# EAGLE design PICBoard (EAGLE 5.12)
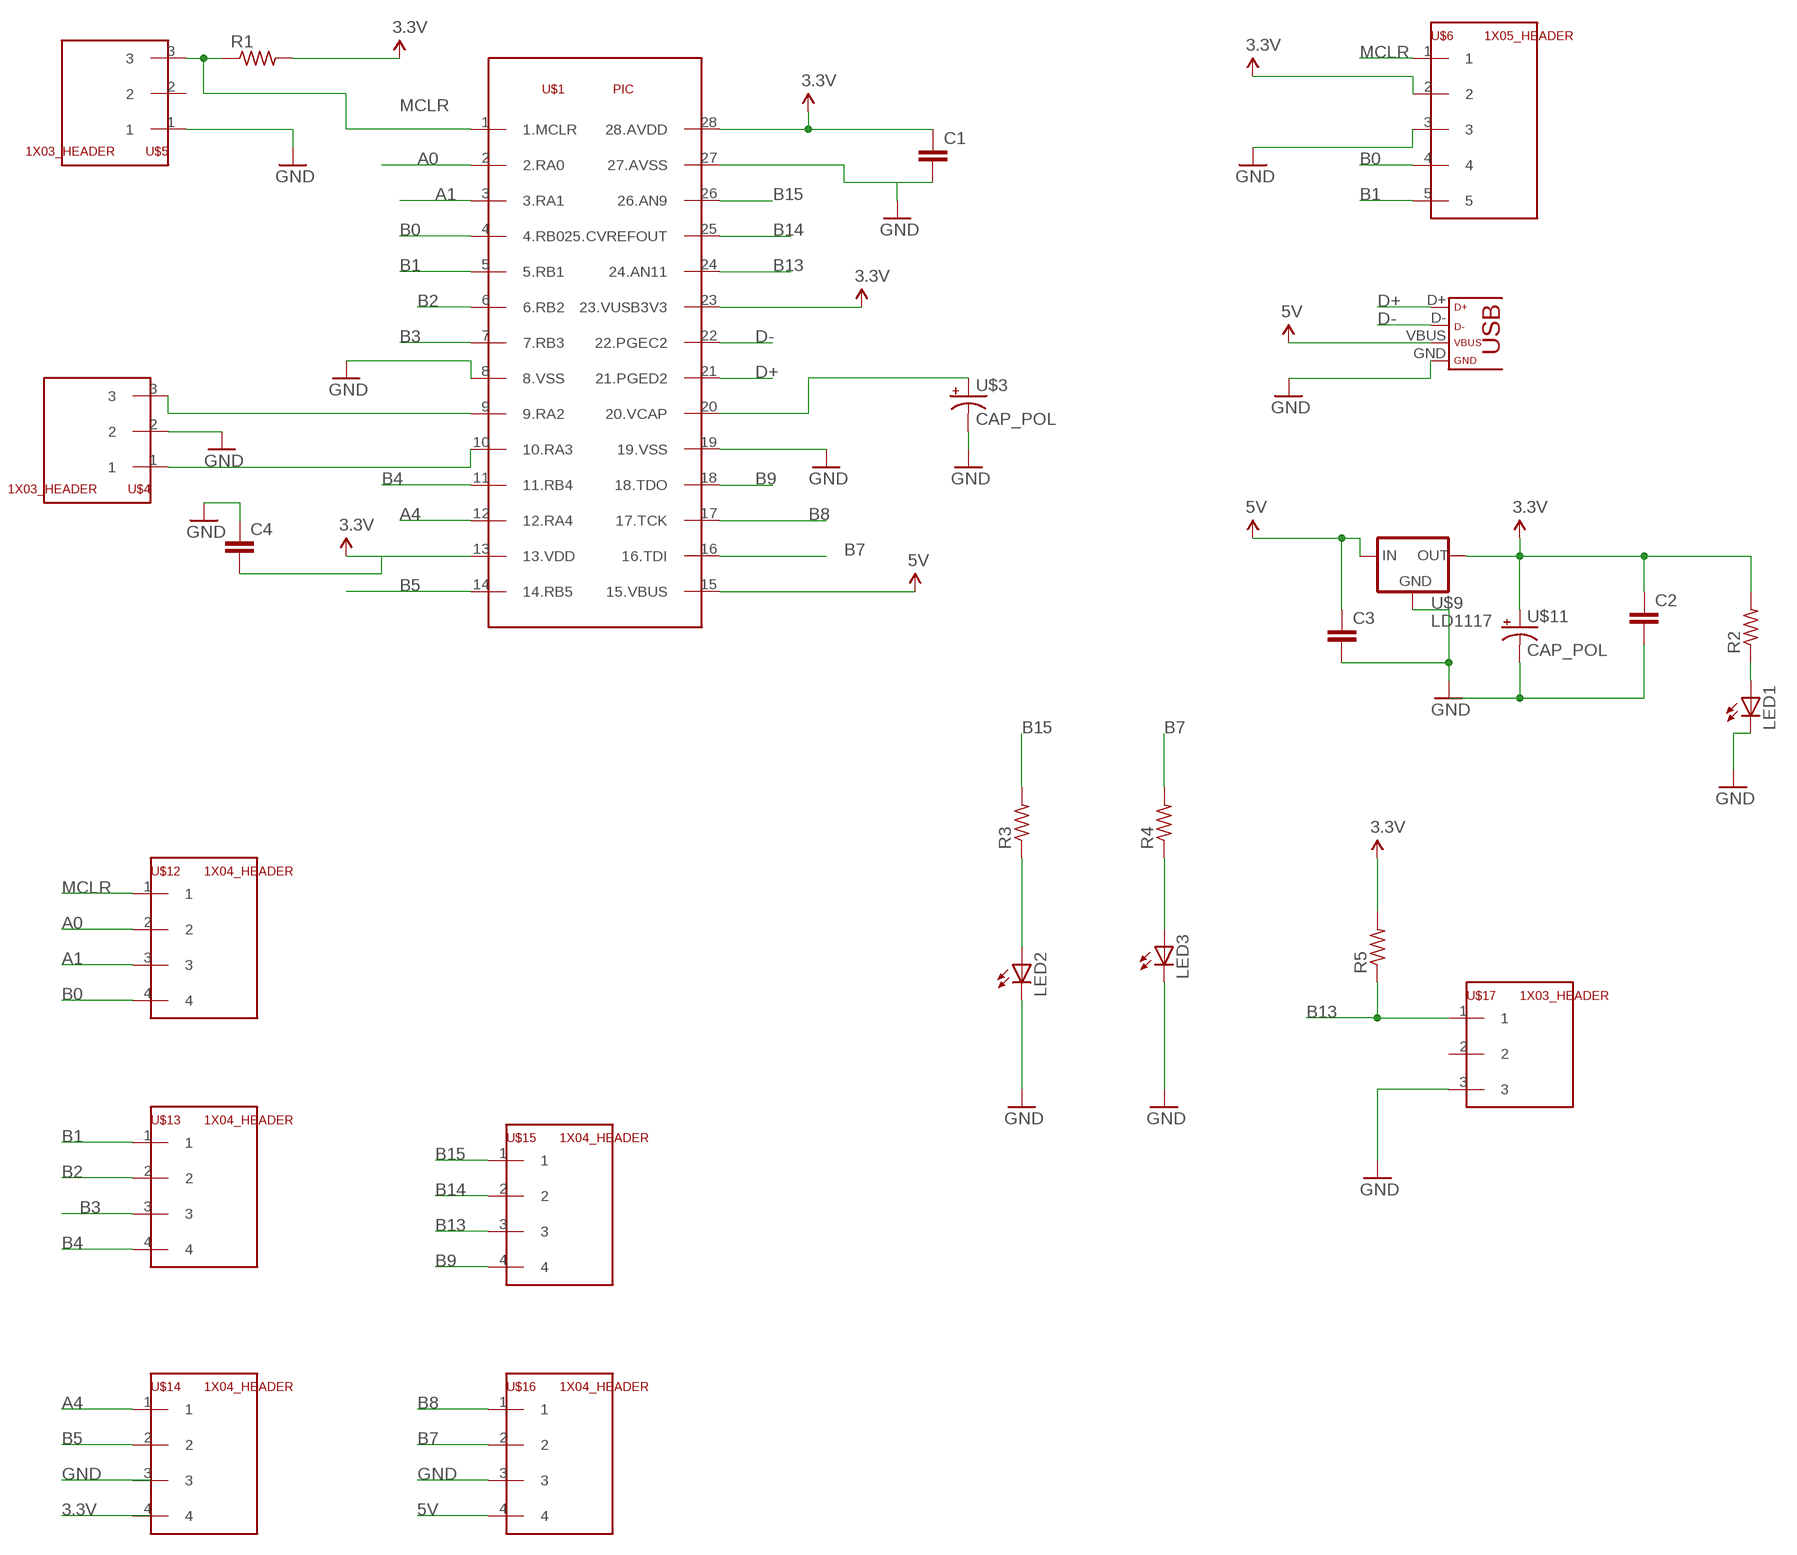
[diagram p0: schematic, sheet 1]

## Parts
C1  C-EU025-030X050  [C025-030X050]
C2  C-EU025-030X050  [C025-030X050]
C3  C-EU025-030X050  [C025-030X050]
C4  C-EU025-030X050  [C025-030X050]
LED1  LED3MM  [LED3MM]
LED2  LED3MM  [LED3MM]
LED3  LED3MM  [LED3MM]
R1  R-US_0207/12  [0207/12]
R2  R-US_0207/12  [0207/12]
R3  R-US_0207/12  [0207/12]
R4  R-US_0207/12  [0207/12]
R5  R-US_0207/12  [0207/12]
U$1  PIC  [DIL28-3]
U$3  CAP_POL  [CAP_POL_D]
U$4  1X03_HEADER  [1X03]
U$5  1X03_HEADER  [1X03]
U$6  1X05_HEADER  [1X05]
U$7  USB  [USB-MINIB]
U$9  LD1117  [TO220]
U$11  CAP_POL  [CAP_POL_D]
U$12  1X04_HEADER  [1X04]
U$13  1X04_HEADER  [1X04]
U$14  1X04_HEADER  [1X04]
U$15  1X04_HEADER  [1X04]
U$16  1X04_HEADER  [1X04]
U$17  1X03_HEADER  [1X03]

## Nets
3.3V: C1.1 C2.1 C4.2 R1.2 R2.2 R5.2 U$1.13(13.VDD) U$1.23(23.VUSB3V3) U$1.28(28.AVDD) U$6.2 U$9.2(OUT) U$11.1(+)
5V: C3.1 U$1.15(15.VBUS) U$7.VBUS U$9.3(IN) U$16.4
A0: U$1.2(2.RA0) U$12.2
A1: U$1.3(3.RA1) U$12.3
A4: U$1.12(12.RA4) U$14.1
B0: U$1.4(4.RB0) U$6.4 U$12.4
B1: U$1.5(5.RB1) U$6.5 U$13.1
B2: U$1.6(6.RB2) U$13.2
B3: U$1.7(7.RB3) U$13.3
B4: U$1.11(11.RB4) U$13.4
B5: U$1.14(14.RB5) U$14.2
B7: R4.2 U$1.16(16.TDI) U$16.2
B8: U$1.17(17.TCK) U$16.1
B9: U$1.18(18.TDO) U$15.4
B13: R5.1 U$1.24(24.AN11) U$15.3 U$17.1
B14: U$1.25(25.CVREFOUT) U$15.2
B15: R3.2 U$1.26(26.AN9) U$15.1
D+: U$1.21(21.PGED2) U$7.D+
D-: U$1.22(22.PGEC2) U$7.D-
GND: C1.2 C3.2 C4.1 LED1.K(C) LED2.K(C) LED3.K(C) U$1.8(8.VSS) U$1.19(19.VSS) U$1.27(27.AVSS) U$3.2(-) U$4.2 U$5.1 U$6.3 U$7.GND U$9.1(GND) U$16.3 U$17.3
MCLR: R1.1 U$1.1(1.MCLR) U$5.3 U$6.1 U$12.1
N$1: U$1.20(20.VCAP) U$3.1(+)
N$2: LED3.A R4.1
N$3: LED1.A R2.1
N$4: C2.2 U$11.2(-)
N$5: U$1.10(10.RA3) U$4.1
N$6: U$1.9(9.RA2) U$4.3
N$7: LED2.A R3.1
Unconnected: U$5.2 U$14.3 U$14.4 U$17.2

## Library data of the parts
C1-C4 = ME433_Hr:C-EU: CAPACITOR, European symbol
LED1-LED3 = ME433_Hr:LED: LED OSRAM: - CHIPLED LG R971, LG N971, LY N971, LG Q971, LY Q971, LO R971, LY R971 LH N974, LH R974 LS Q976, LO Q976, LY Q976 LO Q996 - Hyper CHIPLED LW Q18S LB Q993, LB Q99A, LB R99A - SideLED LS A670, LO A670, LY A670, LG A670, LP A670 LB A673, LV A673, LT A673, LW A673 LH A674 LY A675 LS A676, LA A676, LO A676, LY A676, LW A676 LS A679, LY A679, LG A679 - Hyper Micro SIDELED® LS Y876, LA Y876, LO Y876, LY Y876 LT Y87S - SmartLED LW L88C, LW L88S LB L89C, LB L89S, LG L890 LS L89K, LO L89K, LY L89K LS L896, LA L896, LO L896, LY L896 - TOPLED LS T670, LO T670, LY T670, LG T670, LP T670 LSG T670, LSP T670, LSY T670, LOP T670, LYG T670 LG T671, LOG T671, LSG T671 LB T673, LV T673, LT T673, LW T673 LH T674 LS T676, LA T676, LO T676, LY T676, LB T676, LH T676, LSB T676, LW T676 LB T67C, LV T67C, LT T67C, LS T67K, LO T67K, LY T67K, LW E67C LS E67B, LA E67B, LO E67B, LY E67B, LB E67C, LV E67C, LT E67C LW T67C LS T679, LY T679, LG T679 LS T770, LO T770, LY T770, LG T770, LP T770 LB T773, LV T773, LT T773, LW T773 LH T774 LS E675, LA E675, LY E675, LS T675 LS T776, LA T776, LO T776, LY T776, LB T776 LHGB T686 LT T68C, LB T68C - Hyper Mini TOPLED® LB M676 - Mini TOPLED Santana® LG M470 LS M47K, LO M47K, LY M47K Source: http://www.osram.convergy.de LUXEON: - LUMILED® LXK2-PW12-R00, LXK2-PW12-S00, LXK2-PW14-U00, LXK2-PW14-V00 LXK2-PM12-R00, LXK2-PM12-S00, LXK2-PM14-U00 LXK2-PE12-Q00, LXK2-PE12-R00, LXK2-PE12-S00, LXK2-PE14-T00, LXK2-PE14-U00 LXK2-PB12-K00, LXK2-PB12-L00, LXK2-PB12-M00, LXK2-PB14-N00, LXK2-PB14-P00, LXK2-PB14-Q00 LXK2-PR12-L00, LXK2-PR12-M00, LXK2-PR14-Q00, LXK2-PR14-R00 LXK2-PD12-Q00, LXK2-PD12-R00, LXK2-PD12-S00 LXK2-PH12-R00, LXK2-PH12-S00 LXK2-PL12-P00, LXK2-PL12-Q00, LXK2-PL12-R00 Source: www.luxeon.com KINGBRIGHT: KA-3528ASYC Source: www.kingbright.com
R1-R5 = ME433_Hr:R-US_: RESISTOR, American symbol
U$1 = ME433_Hr:PIC
U$3 U$11 = ME433_Hr:CAP_POL
U$4 U$5 U$17 = ME433_Hr:1X03_HEADER
U$6 = ME433_Hr:1X05_HEADER
U$7 = ME433_Hr:USB
U$9 = ME433_Hr:LD1117
U$12-U$16 = ME433_Hr:1X04_HEADER

## Board
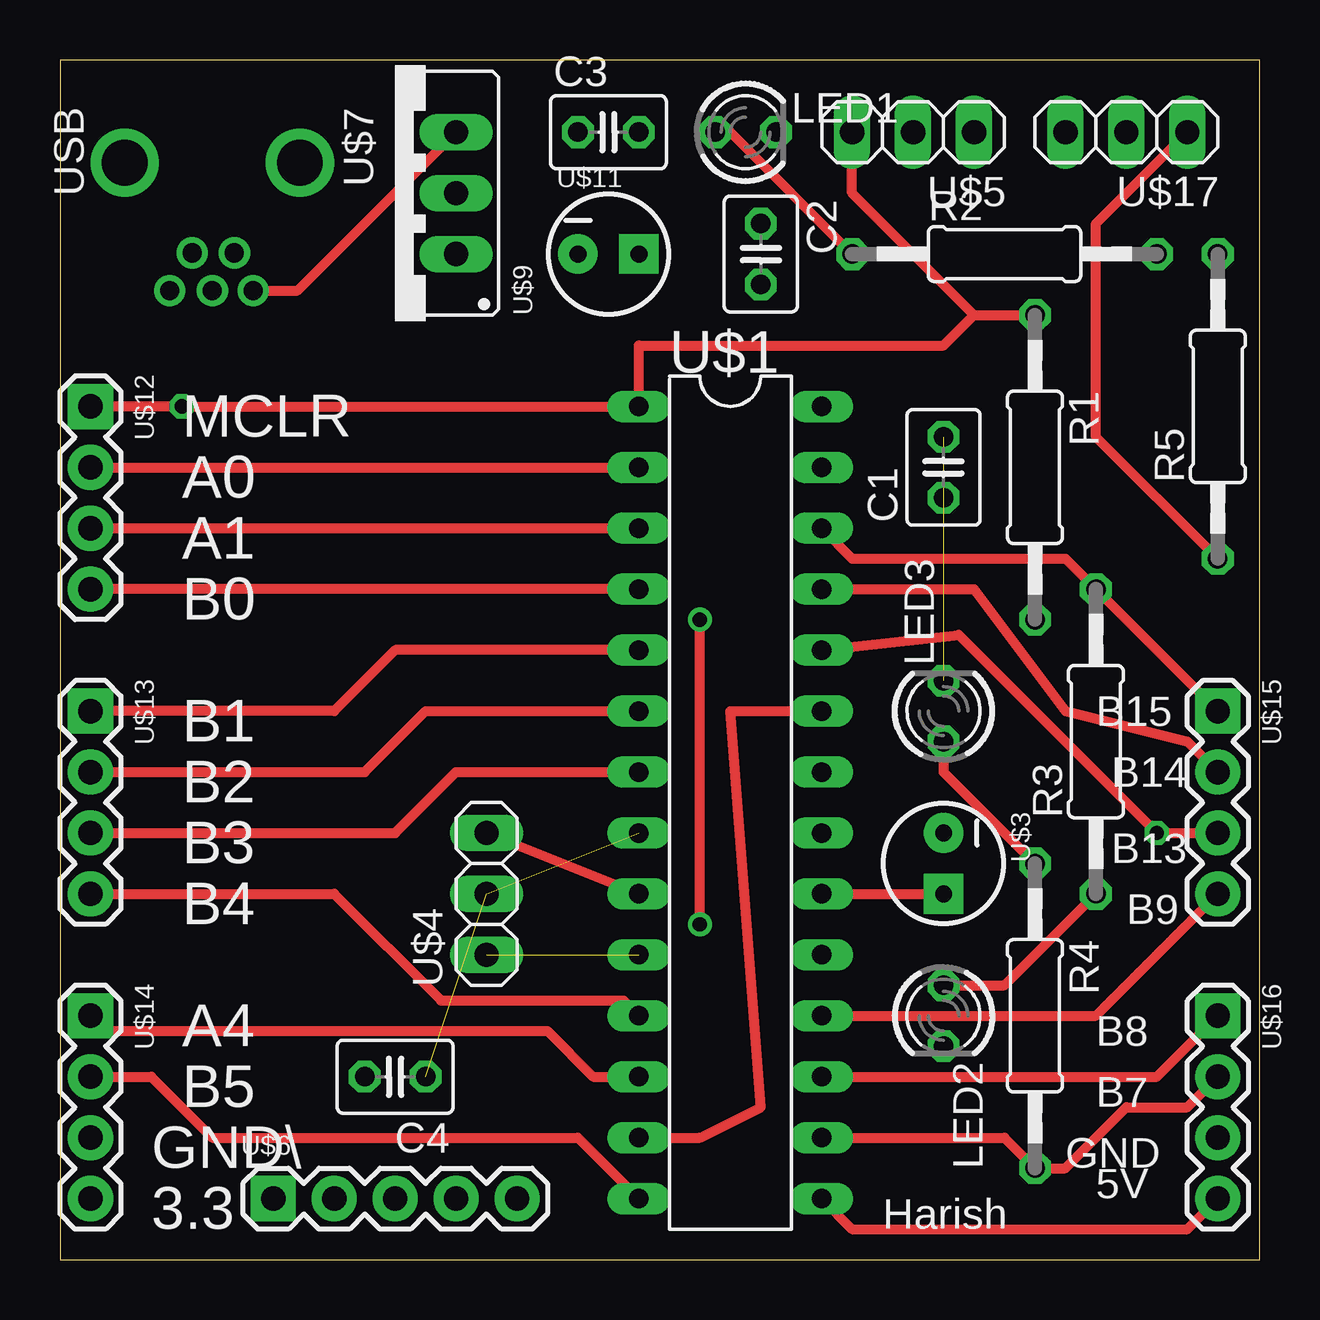
[diagram p1: board, top side]
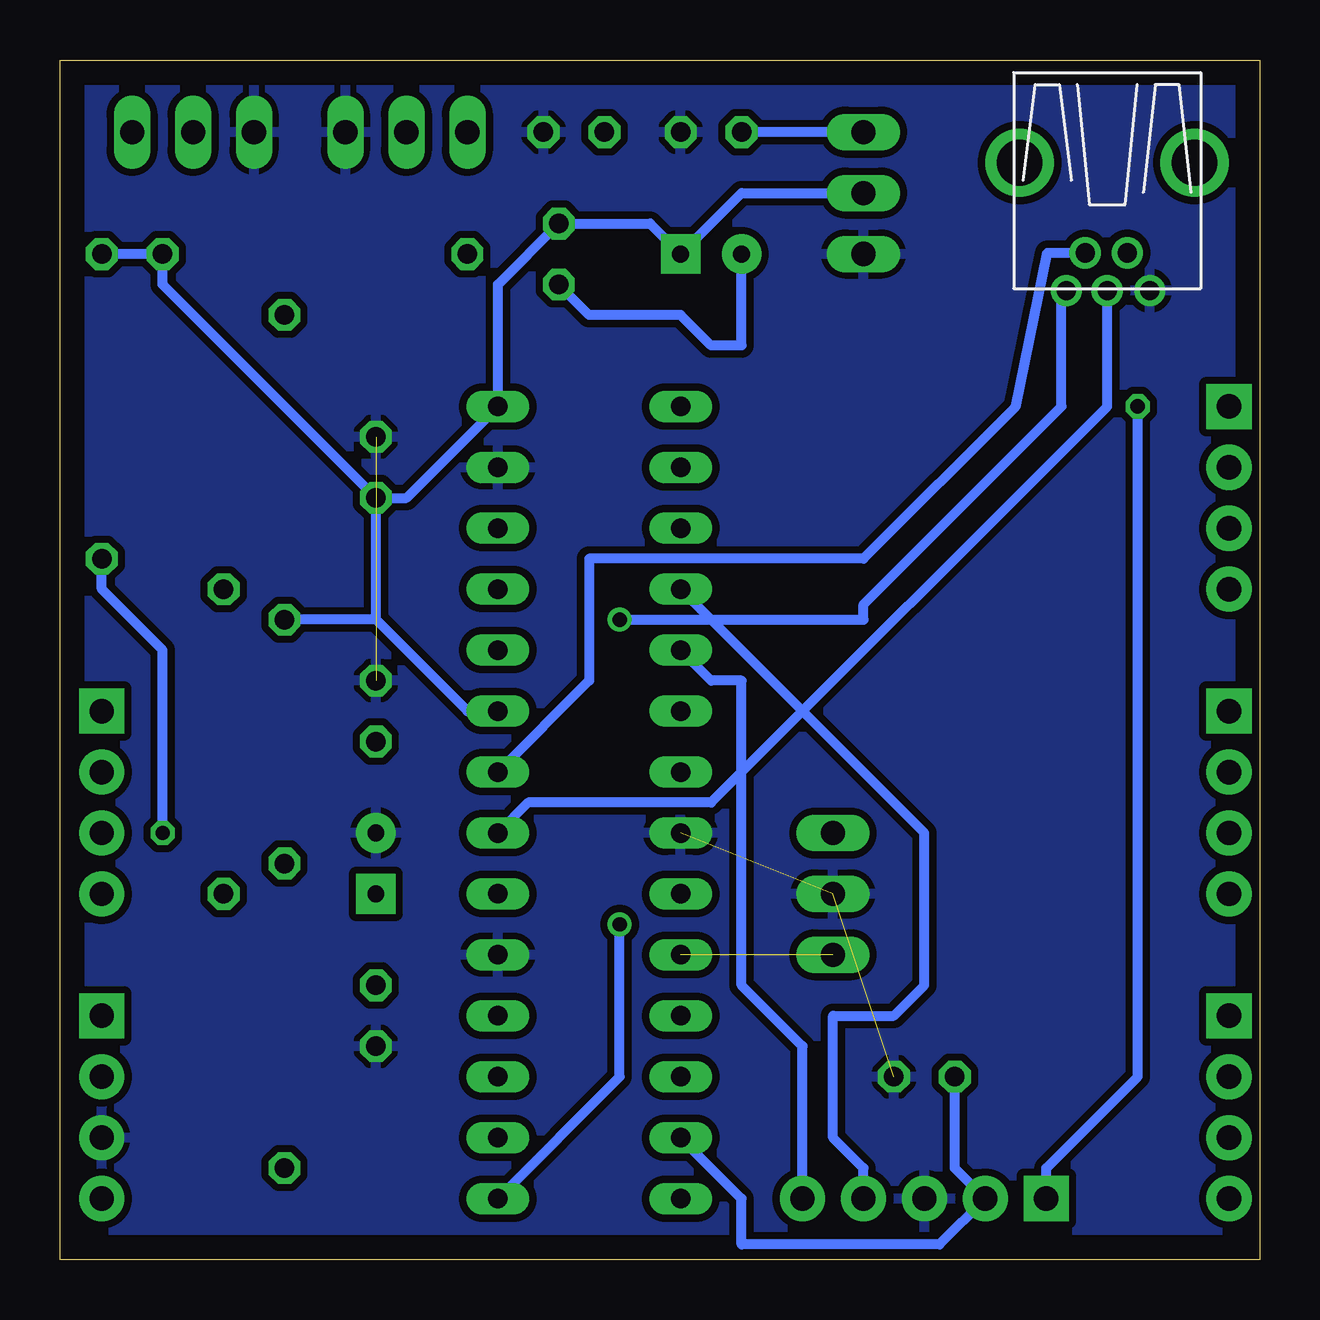
[diagram p2: board, bottom side, seen from below]

Size 50 x 50 mm. Coordinates in mm from the lower left corner, seen from the top.
Outline: 0,0 50,0 50,50 0,50 0,0
Copper layers (1*16): Top 0.035mm / dielectric 1.5mm / Bottom 0.035mm
Design rules "default": minimum track width 10mil, minimum drill 24mil, track to track 8mil, track to pad 8mil, pad to pad 8mil, via to via 8mil, smd to smd 8mil, copper to edge 40mil, drill to drill 8mil, minimum pad ring 10mil, minimum via ring 8mil, stop-mask expansion 4mil, vias tented up to drill 0mil, thermal gap 10mil

### Footprints (pad centres in the part's own frame; a part is rotated, then mirrored left to right if it is on the bottom)
C025-030X050 = drill 0.813 octagon: 1 -1.27,0; 2 1.27,0
LED3MM = drill 0.813 octagon: A -1.27,0; K 1.27,0
0207/12 = drill 0.813 octagon: 1 -6.35,0; 2 6.35,0
DIL28-3 = drill 0.813 long: 1 -16.51,-3.81; 2 -13.97,-3.81; 3 -11.43,-3.81; 4 -8.89,-3.81; 5 -6.35,-3.81; 6 -3.81,-3.81; 7 -1.27,-3.81; 8 1.27,-3.81; 9 3.81,-3.81; 10 6.35,-3.81; 11 8.89,-3.81; 12 11.43,-3.81; 13 13.97,-3.81; 14 16.51,-3.81; 15 16.51,3.81; 16 13.97,3.81; 17 11.43,3.81; 18 8.89,3.81; 19 6.35,3.81; 20 3.81,3.81; 21 1.27,3.81; 22 -1.27,3.81; 23 -3.81,3.81; 24 -6.35,3.81; 25 -8.89,3.81; 26 -11.43,3.81; 27 -13.97,3.81; 28 -16.51,3.81
CAP_POL_D = drill 0.7 pad 1.651 square: 1 1.27,0 | drill 0.7 pad 1.651 round: 2 -1.27,0
1X03 = drill 1.016 long: 1 -2.54,0; 2 0,0; 3 2.54,0
1X05 = drill 1.016 pad 1.88 square: 1 0,0 | drill 1.016 pad 1.88 round: 2 2.54,0; 3 5.08,0; 4 7.62,0; 5 10.16,0
USB-MINIB = drill 0.8 round: D+ 4.064,0; D- 2.489,0.914; GND 4.064,-1.778; ID 2.489,-0.838; VBUS 4.064,1.702 | drill 1.9 round: P$6 -1.27,-3.65; P$7 -1.27,3.65
TO220 = drill 1.016 long: 1 -2.54,0; 2 0,0; 3 2.54,0
1X04 = drill 1.016 pad 1.88 square: 1 0,0 | drill 1.016 pad 1.88 round: 2 2.54,0; 3 5.08,0; 4 7.62,0

### Placement (x,y rotation side)
C1  36.83,33.02 90 top
C2  29.21,41.91 270 top
C3  22.86,46.99 0 top
C4  13.97,7.62 180 top
LED1  28.57,46.99 0 top
LED2  36.83,10.16 270 top
LED3  36.83,22.86 90 top
R1  40.64,33.02 270 top
R2  39.37,41.91 0 top
R3  43.18,21.59 90 top
R4  40.64,10.16 270 top
R5  48.26,35.56 90 top
U$1  27.94,19.05 270 top
U$3  36.83,16.51 270 top
U$4  17.78,15.24 90 top
U$5  35.56,46.99 180 top
U$6  8.89,2.54 0 top
U$7  6.35,44.45 270 top
U$9  16.51,44.45 90 top
U$11  22.86,41.91 0 top
U$12  1.27,35.56 270 top
U$13  1.27,22.86 270 top
U$14  1.27,10.16 270 top
U$15  48.26,22.86 270 top
U$16  48.26,10.16 270 top
U$17  44.45,46.99 180 top

### Tracks (layer width: path | path; a pad name or v marks a point on that pad's centre or on a via)
3.3V
  Top 0.406: U$1.13 26.67,5.08 29.21,6.35 27.94,22.86 U$1.23
  Bottom 0.406: C4.2 12.7,3.81 U$6.2 13.34,0.64 21.59,0.64 21.59,2.54 U$1.13 | U$1.23 33.02,22.86 36.83,26.67 | 36.83,26.67 R1.2 | 36.83,26.67 C1.1 | C1.1 35.56,31.75 U$1.28 31.75,40.64 C2.1 25.4,43.18 U$11.1 21.59,44.45 U$9.2 | C1.1 45.72,40.64 R2.2 R5.2
5V  (via drill 0.6)
  Top 0.406: U$1.15 33.02,1.27 46.99,1.27 U$16.4 | U$7.VBUS 9.91,40.39 U$9.3 | v26.67,13.97 v26.67,26.67
  Bottom 0.406: U$9.3 C3.1 | U$1.15 26.67,7.62 v26.67,13.97 | v26.67,26.67 16.51,26.67 16.51,27.3 8.26,35.56 8.26,40.18 U$7.VBUS
A0
  Top 0.406: U$12.2 U$1.2
A1
  Top 0.406: U$12.3 U$1.3
A4
  Top 0.406: U$1.12 22.23,7.62 20.32,9.53 1.91,9.53 U$14.1
B0
  Top 0.406: U$1.4 U$12.4
  Bottom 0.406: U$6.4 16.51,3.81 17.78,5.08 17.78,10.16 15.24,10.16 13.97,11.43 13.97,17.78 U$1.4
B1
  Top 0.406: U$13.1 11.43,22.86 13.97,25.4 U$1.5
  Bottom 0.406: U$6.5 19.05,8.89 21.59,11.43 21.59,24.13 22.86,24.13 U$1.5
B2
  Top 0.406: U$13.2 12.7,20.32 15.24,22.86 U$1.6
B3
  Top 0.406: U$13.3 13.97,17.78 16.51,20.32 U$1.7
B4
  Top 0.406: U$13.4 11.43,15.24 15.88,10.79 23.5,10.79 U$1.11
B5
  Top 0.406: U$14.2 3.81,7.62 6.35,5.08 21.59,5.08 U$1.14
B7
  Top 0.406: U$1.16 39.37,5.08 R4.2 41.91,3.81 44.45,6.35 46.99,6.35 U$16.2
B8
  Top 0.406: U$1.17 45.72,7.62 U$16.1
B9
  Top 0.406: U$1.18 43.18,10.16 U$15.4
B13  (via drill 0.6)
  Top 0.406: U$15.3 v45.72,17.78 37.47,26.04 U$1.24 | U$17.1 43.18,43.18 43.18,34.29 R5.1
  Bottom 0.406: R5.1 48.26,27.94 45.72,25.4 v45.72,17.78
B14
  Top 0.406: U$1.25 38.1,27.94 41.91,22.86 46.99,21.59 U$15.2
B15
  Top 0.406: U$15.1 R3.2 41.91,29.21 33.02,29.21 U$1.26
D+
  Bottom 0.406: U$7.D+ 6.35,35.56 22.86,19.05 30.48,19.05 U$1.21
D-
  Bottom 0.406: U$7.D- 8.84,41.96 10.16,35.56 16.51,29.21 27.94,29.21 27.94,24.13 U$1.22
GND  (3 unrouted)
  pour Bottom (isolate 0.305): 0,50 0,0 50,0 50,50
MCLR  (via drill 0.6)
  Top 0.406: U$12.1 v5.08,35.56 U$1.1 24.13,38.1 36.83,38.1 38.1,39.37 | 38.1,39.37 R1.1 | 38.1,39.37 33.02,44.45 U$5.3
  Bottom 0.406: U$6.1 8.89,3.81 5.08,7.62 v5.08,35.56
N$1
  Top 0.406: U$1.20 U$3.1
N$2
  Top 0.406: LED3.A 36.83,20.32 R4.1
N$3
  Top 0.406: LED1.A 27.94,46.99 R2.1
N$4
  Bottom 0.406: U$11.2 21.59,38.1 22.86,38.1 24.13,39.37 27.94,39.37 C2.2
N$5  (1 unrouted)
N$6
  Top 0.406: U$4.3 U$1.9
N$7
  Top 0.406: LED2.A 39.37,11.43 R3.1

### Text on the board
tPlace: MCLR | A0 | A1 | B0 | B1 | B15 | B14 | B2 | B3 | B13 | B4 | B9 | A4 | B8 | B5 | B7 | GND\ | GND | 5V | 3.3 | Harish